# Altium schematic sheet 01-multimodal-powersupply-connections.SchDoc
size A4; SheetNumber: 2; SheetTotal: 12
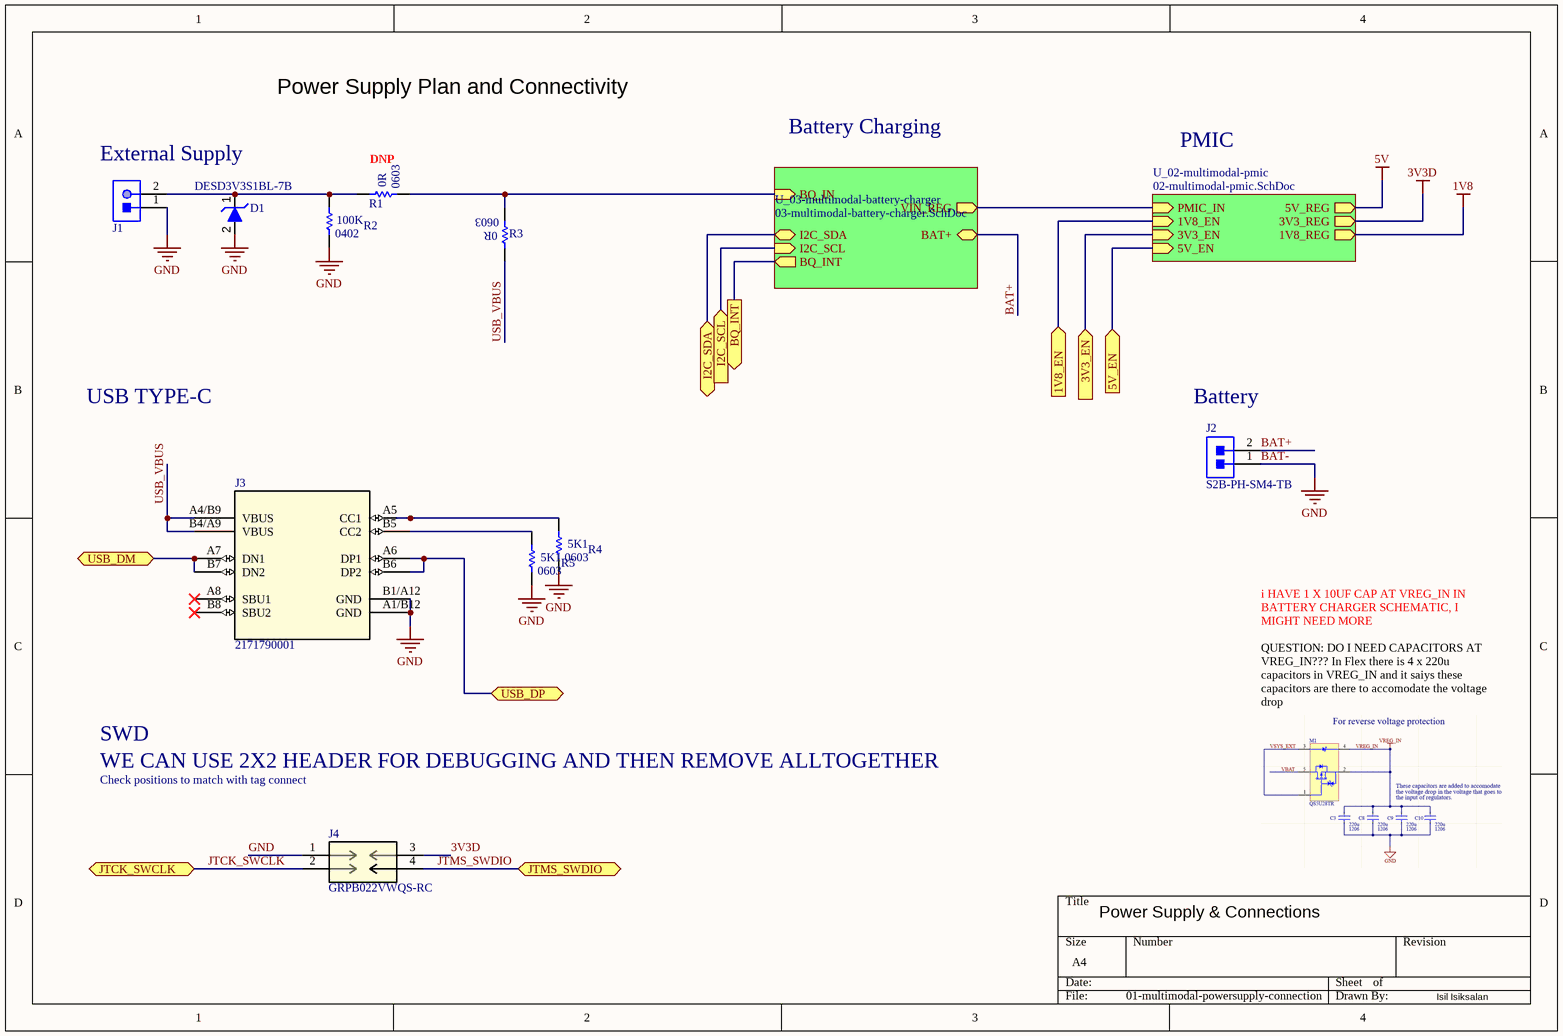
[diagram p0: 01-multimodal-powersupply-connections.SchDoc]

## Parts
D1  DESD3V3S1BL-7B  [TVSDIODE-0402]
J1  TH-Connector  [2-PIN-TH-CONN]  (value not drawn)
J2  S2B-PH-SM4-TB  [2-PIN-SMD-CONN-2-MM-PITCH]
J3  2171790001  [2171790001_MOL]
J4  GRPB022VWQS-RC  [CON4_GRPB022VWQS-RC_SUL]
R1  RMCF0603ZT0R00  [RES-STACK-POLE-0603]  (value not drawn)  (no BOM)
R2  RMCF0402FT100K  [RES-STACK-POLE-0402]  (value not drawn)
R3  RMCF0603ZT0R00  [RES-STACK-POLE-0603]  (value not drawn)
R4  RMCF0603FT5K10  [RES-STACK-POLE-0603]  (value not drawn)
R5  RMCF0603FT5K10  [RES-STACK-POLE-0603]  (value not drawn)

## Sub-sheets
U_02-multimodal-pmic = 02-multimodal-pmic.SchDoc: PMIC_IN (in), 1V8_EN (in), 3V3_EN (in), 5V_EN (in), 5V_REG (out), 3V3_REG (out), 1V8_REG (out)
U_03-multimodal-battery-charger = 03-multimodal-battery-charger.SchDoc: BQ_IN (in), I2C_SDA (bidir), I2C_SCL (in), BQ_INT (out), VIN_REG (out), BAT+ (bidir)

## Ports
1V8_EN (in), 3V3_EN (in), 5V_EN (in), BQ_INT (out), I2C_SCL (in), I2C_SDA (bidir), JTCK_SWCLK (bidir), JTMS_SWDIO (bidir), USB_DM (bidir), USB_DP (bidir)

## Nets
1V8: sheet U_02-multimodal-pmic/1V8_REG
3V3D: J4.3 ; sheet U_02-multimodal-pmic/3V3_REG
5V: sheet U_02-multimodal-pmic/5V_REG
BAT-: D1.2 J1.1 J2.1 J3.A1/B12(GND) J3.B1/A12(GND) J4.1 R2.1 R4.1 R5.1  [also labelled GND]
1V8_EN: port 1V8_EN, sheet U_02-multimodal-pmic/1V8_EN
3V3_EN: port 3V3_EN, sheet U_02-multimodal-pmic/3V3_EN
5V_EN: port 5V_EN, sheet U_02-multimodal-pmic/5V_EN
BAT+: J2.2 ; sheet U_03-multimodal-battery-charger/BAT+
BQ_INT: port BQ_INT, sheet U_03-multimodal-battery-charger/BQ_INT
I2C_SCL: port I2C_SCL, sheet U_03-multimodal-battery-charger/I2C_SCL
I2C_SDA: port I2C_SDA, sheet U_03-multimodal-battery-charger/I2C_SDA
JTCK_SWCLK: J4.2 ; port JTCK_SWCLK
JTMS_SWDIO: J4.4 ; port JTMS_SWDIO
USB_DM: J3.A7(DN1) J3.B7(DN2) ; port USB_DM
USB_DP: J3.A6(DP1) J3.B6(DP2) ; port USB_DP
USB_VBUS: J3.A4/B9(VBUS) J3.B4/A9(VBUS) R3.2
NetD1_1: D1.1 J1.2 R1.2 R2.2
NetJ3_A5: J3.A5(CC1) R4.2
NetJ3_B5: J3.B5(CC2) R5.2
NetR1_1: R1.1 R3.1 ; sheet U_03-multimodal-battery-charger/BQ_IN
(unnamed): sheet U_03-multimodal-battery-charger/VIN_REG, sheet U_02-multimodal-pmic/PMIC_IN

Not connected (* = marked no-connect by the designer): J3 A8(SBU1)* B8(SBU2)*

## Notes on the sheet
- Power Supply Plan and Connectivity
- External Supply
- (near R1) DNP
- Battery Charging
- PMIC
- USB TYPE-C
- (near J2) Battery
- i HAVE 1 X 10UF CAP AT VREG_IN IN BATTERY CHARGER SCHEMATIC, I MIGHT NEED MORE
- QUESTION: DO I NEED CAPACITORS AT VREG_IN??? In Flex there is 4 x 220u capacitors in VREG_IN and it saiys these capacitors are there to accomodate the voltage drop
- SWD
- WE CAN USE 2X2 HEADER FOR DEBUGGING AND THEN REMOVE ALLTOGETHER
- Check positions to match with tag connect
- Power Supply & Connections
- Isil Isiksalan
- (in symbol RMCF0402FT100K) 100K; 0402
- (in symbol RMCF0603FT5K10) 5K1; 0603
- (in symbol RMCF0603ZT0R00) 0R; 0603

## Library data of the parts
D1 = DESD3V3S1BL-7B: TVS DIODE 3.3V 7V DFN1006-2; Manufacturer: Diodes; Direction: Bidirectional; Number of Bidirectional Channels: 1; Min Breakdown Voltage: 3.8V; Peak Pulse Power: 35W; Power Line Protection: No; Max Reverse Leakage Current: 100nA; Element Configuration: Single; Breakdown Voltage: 6.5V; Peak Pulse Current: 5A; Supplier 1: Digi-Key; Manufacturer Part Number: DESD3V3S1BL-7B; RoHS: Yes; Category: TVS Diodes; Stock 1: 514017; Pricing 1: 1=0.32000, 10=0.26000, 100=0.13790, 500=0.09076, 1000=0.06171, 2000=0.05566, 5000=0.04840 (USD); Mount: Surface Mount; Number of Pins: 2; Min Operating Temperature: -65°C; Max Operating Temperature: 150°C; Packaging: Tape and Reel; Package Quantity: 10000; Reverse Standoff Voltage: 3.3V; Clamping Voltage: 7V; Polarity: Bidirectional; Termination: SMD/SMT; Working Voltage: 3.3V; Max Power Dissipation: 35W; Resistor Type: Zener; Radiation Hardening: No; RoHS Compliant: Yes; ComponentLink1URL: https://www.diodes.com/assets/Datasheets/DESD3V3S1BL.pdf; ComponentLink1Description: Datasheet; Supplier Part Number 1: DESD3V3S1BL-7BDICT-ND; ComponentLink2Description: New link; ComponentLink2URL: *
J1 = TH-Connector: Power Connector
J2 = S2B-PH-SM4-TB: CONN HEADER SMD R/A 2POS 2MM; Manufacturer: JST; Supplier 1: Digikey; Manufacturer Part Number: S2B-PH-SM4-TB; RoHS: Yes; Stock 1: 232346; Pricing 1: 1=0.58, 10=0.503, 100=0.4143, 500=0.36024 (USD); Supplier Part Number 1: 455-S2B-PH-SM4-TBCT-ND
J3 = 2171790001: Universal Serial Bus (USB) Shielded I/O Receptacle, Type C, Right-Angle, Top Mount, Surface Mount, Single Row, 16 Circuits, Gold (Au) Plating; Manufacturer_Name: Molex Connector Corporation; Copyright: Copyright (C) 2025 Ultra Librarian. All rights reserved.; Manufacturer_Part_Number: 2171790001; RefDes: RefDes; Type: Type
J4 = GRPB022VWQS-RC: Description; Manufacturer_Name: Sullins; Type: Headers, Male Pins; Copyright: Copyright (C) 2025 Ultra Librarian. All rights reserved.; Manufacturer_Part_Number: GRPB022VWQS-RC; RefDes: RefDes
R1 R3 = RMCF0603ZT0R00: RES 0 OHM JUMPER 1/10W 0603; Supplier 1: Digi-Key; Supplier Part Number 1: RMCF0603ZT0R00CT-ND
R2 = RMCF0402FT100K: RES 100K OHM 1% 1/16W 0402; Supplier 1: Digi-Key; Supplier Part Number 1: RMCF0402FT100KCT-ND
R4 R5 = RMCF0603FT5K10: RES 5.1K OHM 1% 1/10W 0603; Supplier 1: DigiKey; Supplier Part Number 1: RMCF0603FT5K10CT-ND